# EAGLE design main (EAGLE 8.3.1)
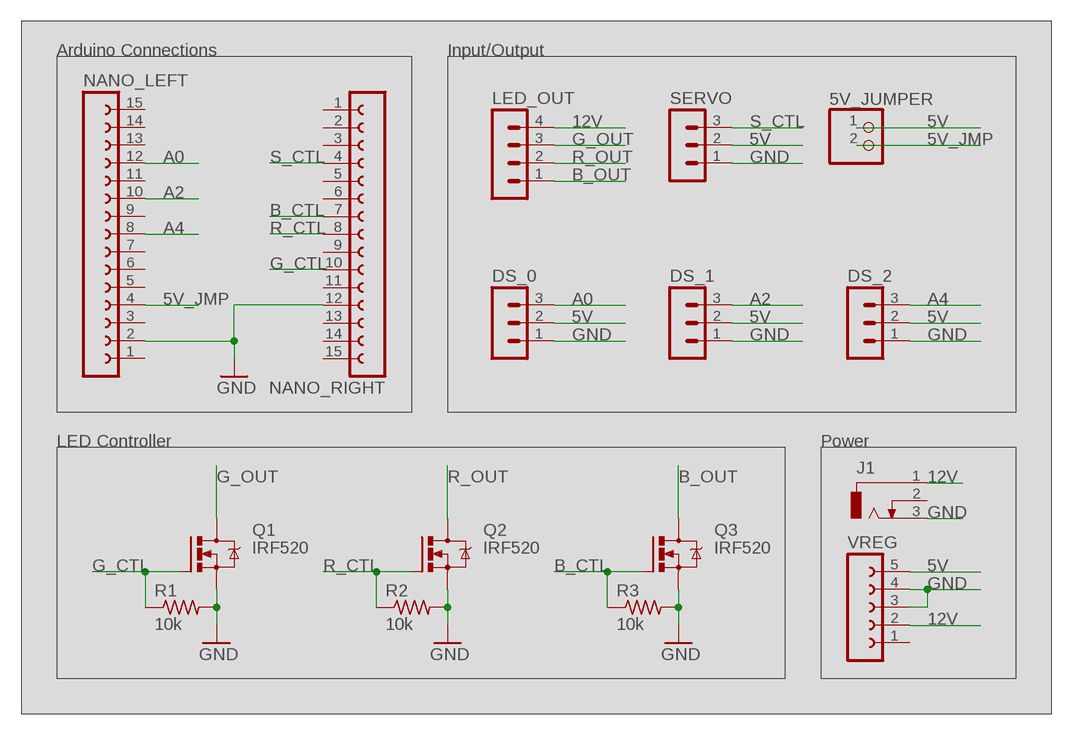
[diagram p0: schematic, sheet 1]

## Parts
5V_JUMPER  PINHD-1X2  [1X02]
DS_0  MA03-1  [MA03-1]
DS_1  MA03-1  [MA03-1]
DS_2  MA03-1  [MA03-1]
J1  DCJ0303  [DCJ0303]
LED_OUT  MA04-1  [MA04-1]
NANO_LEFT  FE15-1  [FE15]
NANO_RIGHT  FE15-1  [FE15]
Q1  IRF520  [TO220BV]
Q2  IRF520  [TO220BV]
Q3  IRF520  [TO220BV]
R1  10k  R-US_0207/7  [0207/7]
R2  10k  R-US_0207/7  [0207/7]
R3  10k  R-US_0207/7  [0207/7]
SERVO  MA03-1  [MA03-1]
VREG  FE05W  [FE05W]

## Nets
5V: 5V_JUMPER.1 DS_0.2 DS_1.2 DS_2.2 SERVO.2 VREG.5
5V_JMP: 5V_JUMPER.2 NANO_LEFT.4
12V: J1.1 LED_OUT.4 VREG.2
A0: DS_0.3 NANO_LEFT.12
A2: DS_1.3 NANO_LEFT.10
A4: DS_2.3 NANO_LEFT.8
B_CTL: NANO_RIGHT.7 Q3.G R3.1
B_OUT: LED_OUT.1 Q3.D
G_CTL: NANO_RIGHT.10 Q1.G R1.1
G_OUT: LED_OUT.3 Q1.D
GND: DS_0.1 DS_1.1 DS_2.1 J1.3 NANO_LEFT.2 NANO_RIGHT.12 Q1.S Q2.S Q3.S R1.2 R2.2 R3.2 SERVO.1 VREG.3 VREG.4
R_CTL: NANO_RIGHT.8 Q2.G R2.1
R_OUT: LED_OUT.2 Q2.D
S_CTL: NANO_RIGHT.4 SERVO.3
Unconnected: J1.2 NANO_LEFT.1 NANO_LEFT.3 NANO_LEFT.5 NANO_LEFT.6 NANO_LEFT.7 NANO_LEFT.9 NANO_LEFT.11 NANO_LEFT.13 NANO_LEFT.14 NANO_LEFT.15 NANO_RIGHT.1 NANO_RIGHT.2 NANO_RIGHT.3 NANO_RIGHT.5 NANO_RIGHT.6 NANO_RIGHT.9 NANO_RIGHT.11 NANO_RIGHT.13 NANO_RIGHT.14 NANO_RIGHT.15 VREG.1

## Notes on the sheet
- Arduino Connections | Input/Output
- LED Controller | Power

## Library data of the parts
5V_JUMPER = pinhead:PINHD-1X2: PIN HEADER
DS_0 DS_1 DS_2 SERVO = con-lstb:MA03-1: PIN HEADER; OC_FARNELL: unknown; OC_NEWARK: unknown
J1 = con-jack:DCJ0303: DC POWER JACK Source: DCJ0303.pdf; OC_FARNELL: unknown; OC_NEWARK: unknown
LED_OUT = con-lstb:MA04-1: PIN HEADER; OC_FARNELL: unknown; OC_NEWARK: unknown
NANO_LEFT NANO_RIGHT = con-lsta:FE15-1: FEMALE HEADER; OC_FARNELL: unknown; OC_NEWARK: unknown
Q1-Q3 = transistor-power:IRF520: HEXFET Power MOSFET
R1-R3 = rcl:R-US_: RESISTOR, American symbol
VREG = con-lsta:FE05W: FEMALE HEADER; OC_FARNELL: unknown; OC_NEWARK: unknown

## Board
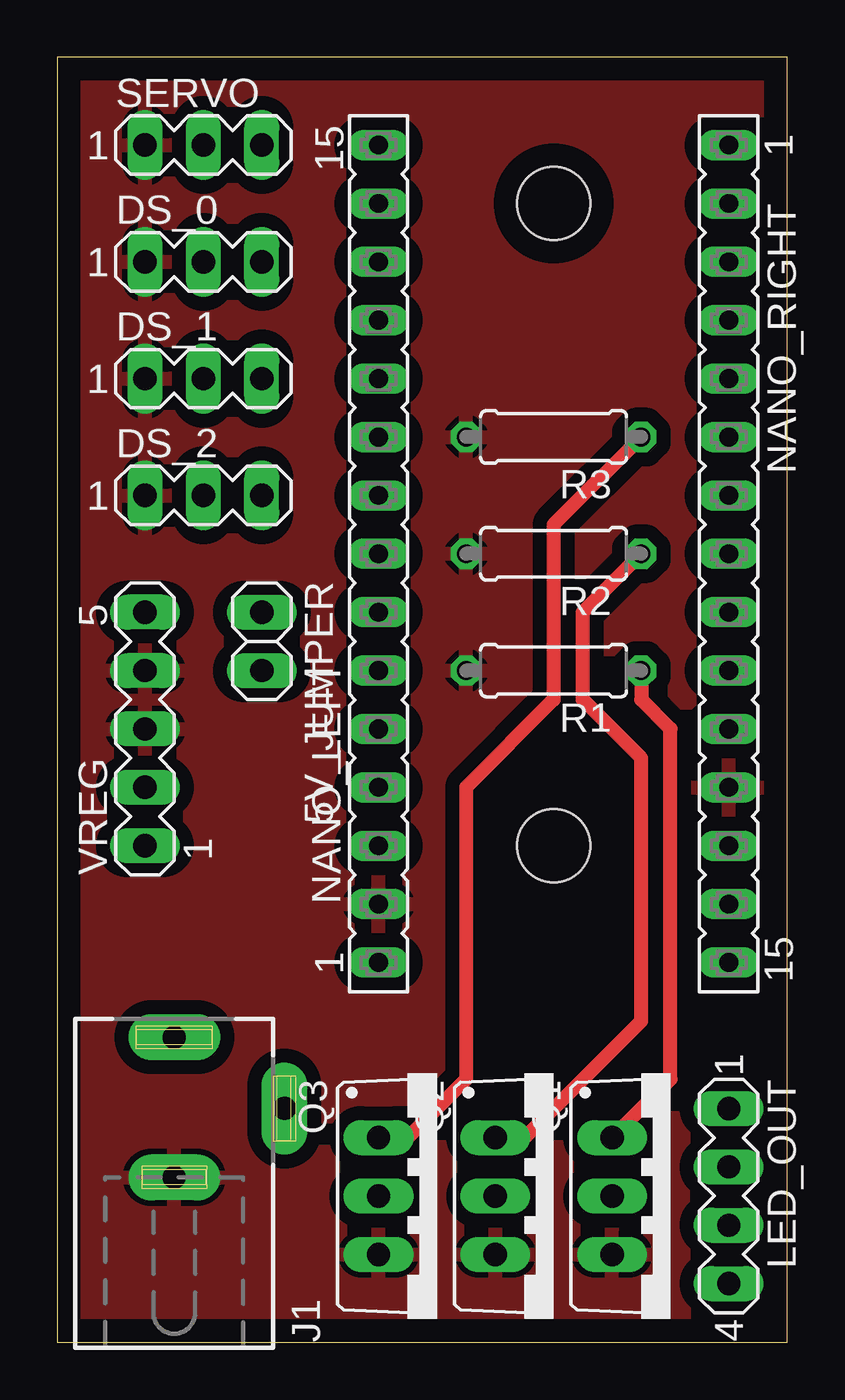
[diagram p1: board, top side]
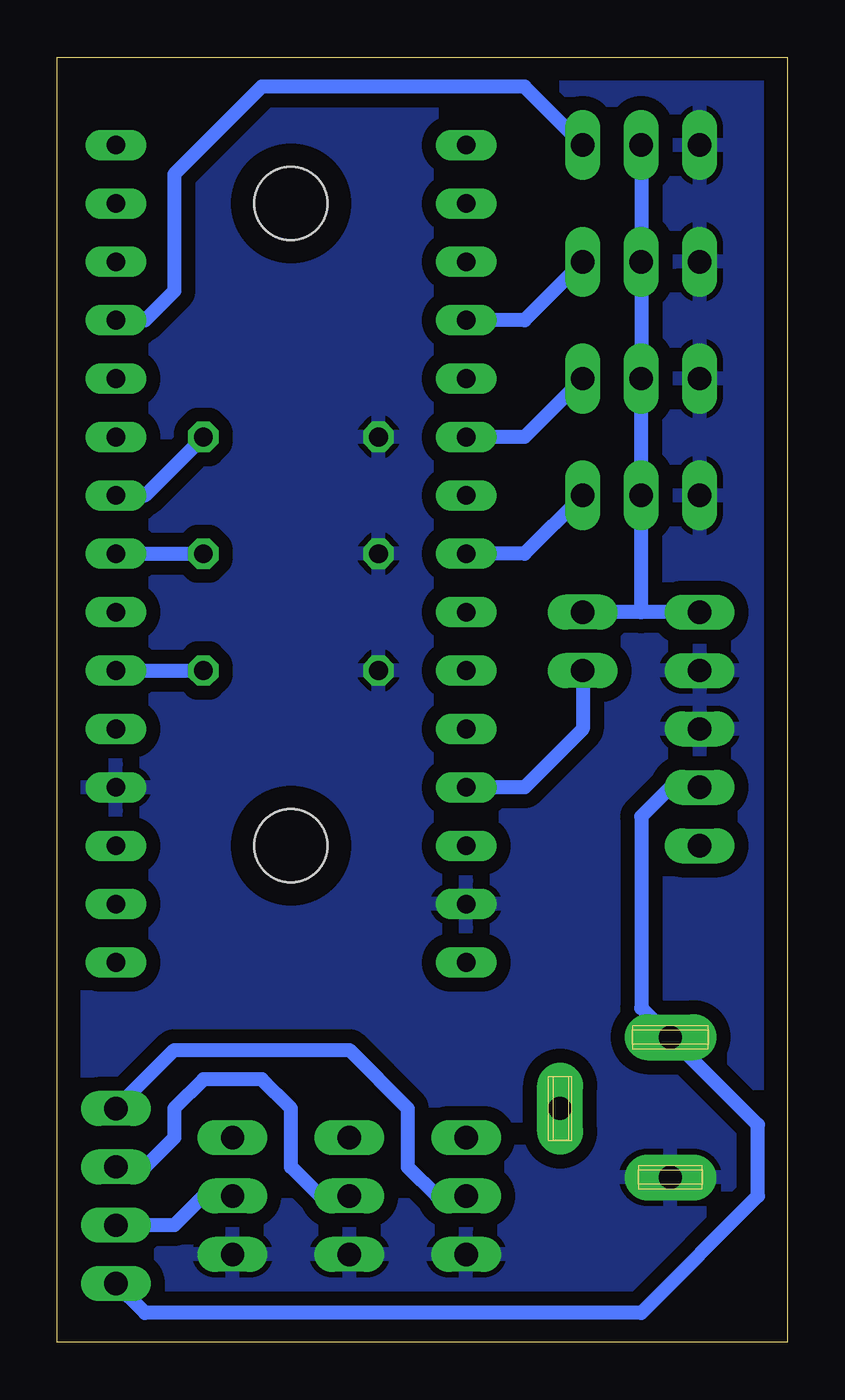
[diagram p2: board, bottom side, seen from below]

Size 31.75 x 55.88 mm. Coordinates in mm from the lower left corner, seen from the top.
Outline: 0,0 31.75,0 31.75,55.88 0,55.88 0,0
Copper layers (1*16): Top 0.035mm / dielectric 1.5mm / Bottom 0.035mm
Design rules "default *": minimum track width 12mil, minimum drill 0.35mm, track to track 12mil, track to pad 12mil, pad to pad 12mil, via to via 12mil, smd to smd 12mil, copper to edge 40mil, drill to drill 6mil, minimum pad ring 10mil, minimum via ring 8mil, stop-mask expansion 4mil, vias tented up to drill 0mil, thermal gap 10mil
Holes 3.17 mm at 21.59,49.53 21.59,21.59
Milling: area 3.4,13 to 6.7,13.6; area 9.5,8.8 to 10.2,11.6; area 3.7,6.9 to 6.5,7.5

### Footprints (pad centres in the part's own frame; a part is rotated, then mirrored left to right if it is on the bottom)
1X02 = drill 1.016 long: 1 -1.27,0; 2 1.27,0
MA03-1 = drill 1.016 long: 1 -2.54,0; 2 0,0; 3 2.54,0
DCJ0303 = drill 1 pad 2 long: 1 0,3.1; 2 4.8,0; 3 0,-3
MA04-1 = drill 1.016 long: 1 -3.81,0; 2 -1.27,0; 3 1.27,0; 4 3.81,0
FE15 = drill 0.813 long: 1 -17.78,0; 2 -15.24,0; 3 -12.7,0; 4 -10.16,0; 5 -7.62,0; 6 -5.08,0; 7 -2.54,0; 8 0,0; 9 2.54,0; 10 5.08,0; 11 7.62,0; 12 10.16,0; 13 12.7,0; 14 15.24,0; 15 17.78,0
TO220BV = drill 1.016 long: D 0,-2.54; G -2.54,-2.54; S 2.54,-2.54
0207/7 = drill 0.813 octagon: 1 -3.81,0; 2 3.81,0
MA05-1 = drill 1.016 long: 1 -5.08,0; 2 -2.54,0; 3 0,0; 4 2.54,0; 5 5.08,0

### Placement (x,y rotation side)
5V_JUMPER  8.89,30.48 270 top
DS_0  6.35,46.99 0 top
DS_1  6.35,41.91 0 top
DS_2  6.35,36.83 0 top
J1  5.08,10.16 0 top
LED_OUT  29.21,6.35 270 top
NANO_LEFT  13.97,34.29 90 top
NANO_RIGHT  29.21,34.29 270 top
Q1  26.67,6.35 270 top
Q2  21.59,6.35 270 top
Q3  16.51,6.35 270 top
R1  21.59,29.21 180 top
R2  21.59,34.29 180 top
R3  21.59,39.37 180 top
SERVO  6.35,52.07 0 top
VREG  [MA05-1]  3.81,26.67 90 top

### Tracks (layer width: path | path; a pad name or v marks a point on that pad's centre or on a via)
5V
  Bottom 0.61: VREG.5 6.35,31.75 | SERVO.2 DS_0.2 DS_1.2 DS_2.2 6.35,31.75 | 6.35,31.75 5V_JUMPER.1
5V_JMP
  Bottom 0.61: 5V_JUMPER.2 8.89,26.67 11.43,24.13 NANO_LEFT.4
12V
  Bottom 0.61: VREG.2 5.08,24.13 6.35,22.86 6.35,14.53 J1.1 1.27,9.45 1.27,6.35 6.35,1.27 27.94,1.27 LED_OUT.4
A0
  Bottom 0.61: DS_0.3 11.43,44.45 NANO_LEFT.12
A2
  Bottom 0.61: DS_1.3 11.43,39.37 NANO_LEFT.10
A4
  Bottom 0.61: DS_2.3 11.43,34.29 NANO_LEFT.8
B_CTL
  Top 0.61: R3.1 21.59,35.56 21.59,27.94 17.78,24.13 17.78,11.43 15.24,8.89 Q3.G
  Bottom 0.61: NANO_RIGHT.7 27.94,36.83 R3.1
B_OUT
  Bottom 0.61: Q3.D 15.24,6.35 16.51,7.62 16.51,10.16 19.05,12.7 26.67,12.7 LED_OUT.1
G_CTL
  Top 0.61: R1.1 25.4,27.94 26.67,26.67 26.67,11.43 Q1.G
  Bottom 0.61: NANO_RIGHT.10 R1.1
G_OUT
  Bottom 0.61: Q1.D 25.4,6.35 26.67,5.08 LED_OUT.3
GND
  pour Bottom (isolate 0.61): 0,0 31.75,0 31.75,55.88 0,55.88
  pour Top (isolate 0.61): 0,0 0,55.88 31.75,55.88 31.75,0
R_CTL
  Top 0.61: R2.1 22.86,31.75 22.86,27.94 25.4,25.4 25.4,13.97 20.32,8.89 Q2.G
  Bottom 0.61: NANO_RIGHT.8 R2.1
R_OUT
  Bottom 0.61: Q2.D 20.32,6.35 21.59,7.62 21.59,10.16 22.86,11.43 25.4,11.43 26.67,10.16 26.67,8.89 27.94,7.62 LED_OUT.2
S_CTL
  Bottom 0.61: NANO_RIGHT.4 27.94,44.45 26.67,45.72 26.67,50.8 22.86,54.61 11.43,54.61 SERVO.3